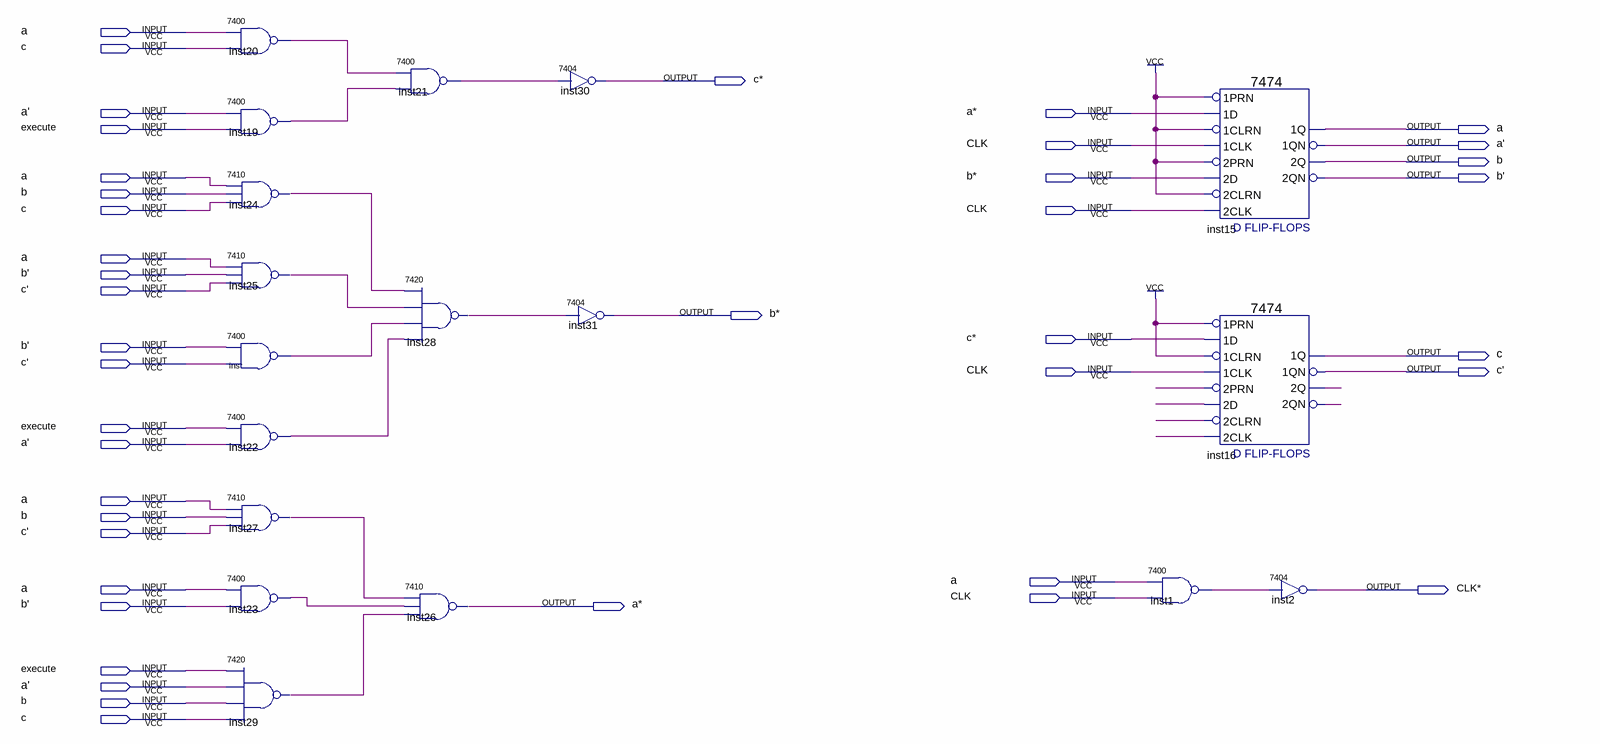
[diagram p0: schematic sheet]
// Quartus schematic Control1.bdf as structural Verilog: 18 symbols, 41 pins
module Control1 (
  inout  a,
  inout  c,
  inout  \a' ,
  inout  \a* ,
  input  execute,
  input  CLK,
  inout  \b* ,
  inout  b,
  inout  \b' ,
  inout  \c' ,
  inout  \c* ,
  output \CLK* 
);

  wire inst1_1, inst16_2q, inst16_2qn, inst19_1, inst20_1, inst21_1, inst22_1, inst23_1, inst24_1, inst25_1,
       inst27_1, inst28_1, inst29_1, inst_1, undriven, undriven_2, undriven_3, undriven_4;

  \7400  inst20 (.\3 (c), .\2 (a), .\1 (inst20_1));
  \7400  inst19 (.\3 (execute), .\2 (\a' ), .\1 (inst19_1));
  \7410  inst24 (.\2 (a), .\3 (b), .\4 (c), .\1 (inst24_1));
  \7410  inst25 (.\2 (a), .\3 (\b' ), .\4 (\c' ), .\1 (inst25_1));
  \7400  inst (.\3 (\c' ), .\2 (\b' ), .\1 (inst_1));
  \7400  inst22 (.\3 (\a' ), .\2 (execute), .\1 (inst22_1));
  \7410  inst27 (.\2 (a), .\3 (b), .\4 (\c' ), .\1 (inst27_1));
  \7400  inst23 (.\3 (\b' ), .\2 (a), .\1 (inst23_1));
  \7420  inst29 (.\4 (b), .\2 (execute), .\3 (\a' ), .\5 (c), .\1 (inst29_1));
  \7400  inst21 (.\3 (inst19_1), .\2 (inst20_1), .\1 (inst21_1));
  \7420  inst28 (.\4 (inst_1), .\2 (inst24_1), .\3 (inst25_1), .\5 (inst22_1), .\1 (inst28_1));
  \7410  inst26 (.\2 (inst27_1), .\3 (inst23_1), .\4 (inst29_1), .\1 (\a* ));
  \7404  inst30 (.\2 (inst21_1), .\1 (\c* ));
  \7404  inst31 (.\2 (inst28_1), .\1 (\b* ));
  \7474  inst15 (
    .\2D (\b* ), .\2PRN (1'b1), .\1CLK (CLK), .\1D (\a* ), .\1PRN (1'b1), .\2CLK (CLK), .\2CLRN (1'b1),
    .\1CLRN (1'b1), .\1QN (\a' ), .\2Q (b), .\2QN (\b' ), .\1Q (a));
  \7474  inst16 (
    .\2D (undriven_4), .\2PRN (undriven), .\1CLK (CLK), .\1D (\c* ), .\1PRN (1'b1), .\2CLK (undriven_2),
    .\2CLRN (undriven_3), .\1CLRN (1'b1), .\1QN (\c' ), .\2Q (inst16_2q), .\2QN (inst16_2qn), .\1Q (c));
  \7400  inst1 (.\3 (CLK), .\2 (a), .\1 (inst1_1));
  \7404  inst2 (.\2 (inst1_1), .\1 (\CLK* ));
endmodule
